# EAGLE schematic power_layout_SLIM (EAGLE 9.6.1)

## Sheet 1 of 2
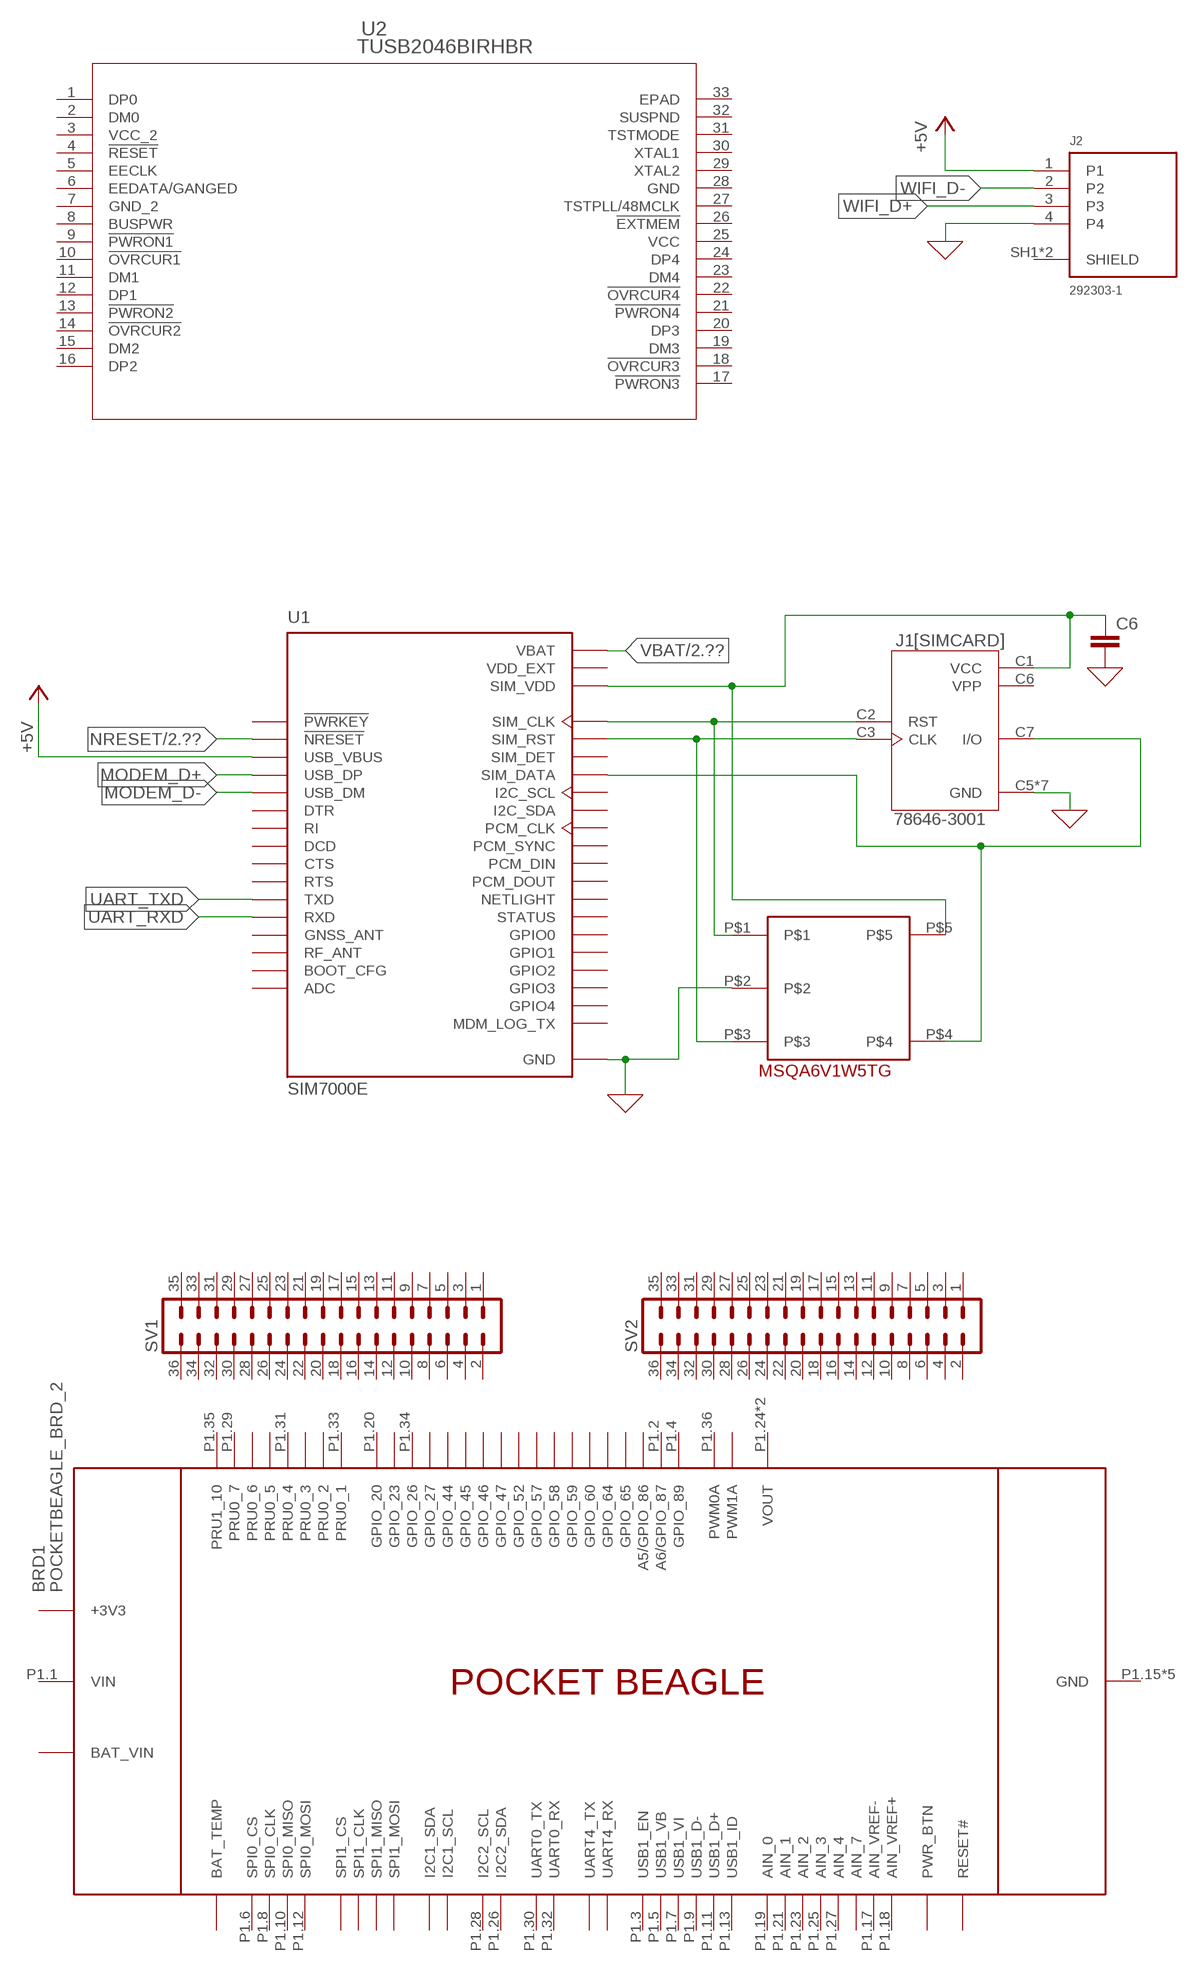
[diagram p0: schematic, sheet 1]

### Parts
BRD1  POCKETBEAGLE_BRD_2  [POCKETBEAGLE_BRD]
C6  C2,5-3  [C2.5-3]
J1[SIMCARD]  78646-3001  [MOLEX_78646-3001]
J2  292303-1  [TE_292303-1]
SV1  MA18-2  [MA18-2]
SV2  MA18-2  [MA18-2]
U1  SIM7000E  [SIMCON_SIM7000E]
U2  TUSB2046BIRHBR  [RHB32_3P45X3P45]
U$1  MSQA6V1W5T2G  [SOT-23-5_M5]

### Nets
0: C6.2 J1[SIMCARD].C5(GND) J1[SIMCARD].G1(GND) J1[SIMCARD].G2(GND) J1[SIMCARD].G3(GND) J1[SIMCARD].G4(GND) J1[SIMCARD].G5(GND) J1[SIMCARD].G6(GND) J2.4 U1.2(GND) U1.17(GND) U1.18(GND) U1.29(GND) U1.39(GND) U1.45(GND) U1.46(GND) U1.54(GND) U1.58(GND) U1.59(GND) U1.61(GND) U1.62(GND) U1.63(GND) U1.64(GND) U1.65(GND) U$1.P$2 ; supply symbol labelled GND ; also sheet 2
+5V: J2.1 U1.24(USB_VBUS) ; also sheet 2
MODEM_D+: U1.27(USB_DP)
MODEM_D-: U1.28(USB_DM)
N$1: C6.1 J1[SIMCARD].C1(VCC) U1.30(SIM_VDD) U$1.P$5
N$2: J1[SIMCARD].C3(CLK) U1.33(SIM_RST) U$1.P$3
N$4: J1[SIMCARD].C2(RST) U1.32(SIM_CLK) U$1.P$1
N$6: J1[SIMCARD].C7(I/O) U1.31(SIM_DATA) U$1.P$4
NRESET: U1.16(!NRESET) ; also sheet 2
UART_RXD: U1.10(RXD)
UART_TXD: U1.9(TXD)
VBAT: U1.55(VBAT) U1.56(VBAT) U1.57(VBAT) ; also sheet 2
WIFI_D+: J2.3
WIFI_D-: J2.2
Unconnected: BRD1.P1.1(VIN) BRD1.P1.2(A6/GPIO_87) BRD1.P1.3(USB1_EN) BRD1.P1.4(GPIO_89) BRD1.P1.5(USB1_VB) BRD1.P1.6(SPI0_CS) BRD1.P1.7(USB1_VI) BRD1.P1.8(SPI0_CLK) BRD1.P1.9(USB1_D-) BRD1.P1.10(SPI0_MISO) BRD1.P1.11(USB1_D+) BRD1.P1.12(SPI0_MOSI) BRD1.P1.13(USB1_ID) BRD1.P1.14(+3V3) BRD1.P1.15(GND) BRD1.P1.16(GND) BRD1.P1.17(AIN_VREF-) BRD1.P1.18(AIN_VREF+) BRD1.P1.19(AIN_0) BRD1.P1.20(GPIO_20) BRD1.P1.21(AIN_1) BRD1.P1.22(GND) BRD1.P1.23(AIN_2) BRD1.P1.24(VOUT) BRD1.P1.25(AIN_3) BRD1.P1.26(I2C2_SDA) BRD1.P1.27(AIN_4) BRD1.P1.28(I2C2_SCL) BRD1.P1.29(PRU0_7) BRD1.P1.30(UART0_TX) BRD1.P1.31(PRU0_4) BRD1.P1.32(UART0_RX) BRD1.P1.33(PRU0_1) BRD1.P1.34(GPIO_26) BRD1.P1.35(PRU1_10) BRD1.P1.36(PWM0A) BRD1.P2.1(PWM1A) BRD1.P2.2(GPIO_59) BRD1.P2.3(GPIO_23) BRD1.P2.4(GPIO_58) BRD1.P2.5(UART4_RX) BRD1.P2.6(GPIO_57) BRD1.P2.7(UART4_TX) BRD1.P2.8(GPIO_60) BRD1.P2.9(I2C1_SCL) BRD1.P2.10(GPIO_52) BRD1.P2.11(I2C1_SDA) BRD1.P2.12(PWR_BTN) BRD1.P2.13(VOUT) BRD1.P2.14(BAT_VIN) BRD1.P2.15(GND) BRD1.P2.16(BAT_TEMP) BRD1.P2.17(GPIO_65) BRD1.P2.18(GPIO_47) BRD1.P2.19(GPIO_27) BRD1.P2.20(GPIO_64) BRD1.P2.21(GND) BRD1.P2.22(GPIO_46) BRD1.P2.23(+3V3) BRD1.P2.24(GPIO_44) BRD1.P2.25(SPI1_MOSI) BRD1.P2.26(RESET#) BRD1.P2.27(SPI1_MISO) BRD1.P2.28(PRU0_6) BRD1.P2.29(SPI1_CLK) BRD1.P2.30(PRU0_3) BRD1.P2.31(SPI1_CS) BRD1.P2.32(PRU0_2) BRD1.P2.33(GPIO_45) BRD1.P2.34(PRU0_5) BRD1.P2.35(A5/GPIO_86) BRD1.P2.36(AIN_7) J2.SH1(SHIELD) J2.SH2(SHIELD) SV1.1 SV1.2 SV1.3 SV1.4 SV1.5 SV1.6 SV1.7 SV1.8 SV1.9 SV1.10 SV1.11 SV1.12 SV1.13 SV1.14 SV1.15 SV1.16 SV1.17 SV1.18 SV1.19 SV1.20 SV1.21 SV1.22 SV1.23 SV1.24 SV1.25 SV1.26 SV1.27 SV1.28 SV1.29 SV1.30 SV1.31 SV1.32 SV1.33 SV1.34 SV1.35 SV1.36 SV2.1 SV2.2 SV2.3 SV2.4 SV2.5 SV2.6 SV2.7 SV2.8 SV2.9 SV2.10 SV2.11 SV2.12 SV2.13 SV2.14 SV2.15 SV2.16 SV2.17 SV2.18 SV2.19 SV2.20 SV2.21 SV2.22 SV2.23 SV2.24 SV2.25 SV2.26 SV2.27 SV2.28 SV2.29 SV2.30 SV2.31 SV2.32 SV2.33 SV2.34 SV2.35 SV2.36 U1.1(!PWRKEY) U1.3(DTR) U1.4(RI) U1.5(DCD) U1.6(BOOT_CFG) U1.7(CTS) U1.8(RTS) U1.11(PCM_CLK) U1.12(PCM_SYNC) U1.13(PCM_DIN) U1.14(PCM_DOUT) U1.23(MDM_LOG_TX) U1.25(ADC) U1.34(SIM_DET) U1.37(I2C_SDA) U1.38(I2C_SCL) U1.48(GPIO4) U1.49(GPIO1) U1.50(GPIO0) U1.52(NETLIGHT) U1.53(GNSS_ANT) U1.60(RF_ANT) U1.66(STATUS) U1.67(GPIO2) U1.68(GPIO3) U2.1(DP0) U2.2(DM0) U2.4(!RESET) U2.5(EECLK) U2.6(EEDATA/GANGED) U2.8(BUSPWR) U2.9(!PWRON1) U2.10(!OVRCUR1) U2.11(DM1) U2.12(DP1) U2.13(!PWRON2) U2.14(!OVRCUR2) U2.15(DM2) U2.16(DP2) U2.17(!PWRON3) U2.18(!OVRCUR3) U2.19(DM3) U2.20(DP3) U2.21(!PWRON4) U2.22(!OVRCUR4) U2.23(DM4) U2.24(DP4) U2.26(!EXTMEM) U2.27(TSTPLL/48MCLK) U2.29(XTAL2) U2.30(XTAL1) U2.31(TSTMODE) U2.32(SUSPND) U2.33(EPAD)

## Sheet 2 of 2
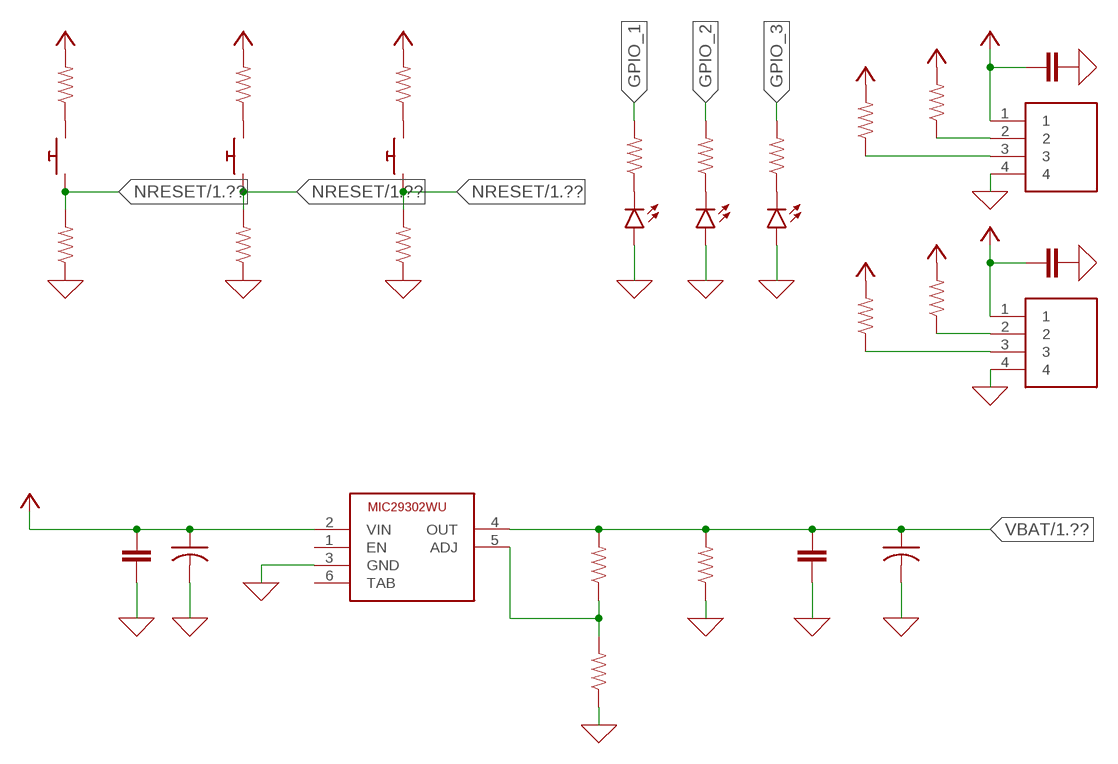
[diagram p1: schematic, sheet 2]

### Parts
C1  C2,5-3  [C2.5-3]
C2  0.1uF  C2,5-3  [C2.5-3]
C3  C2,5-3  [C2.5-3]
C4  C-US025-024X044  [C025-024X044]
C5  C-US025-024X044  [C025-024X044]
C7  0.1uF  C2,5-3  [C2.5-3]
D1  LED-3MM-NO_SILK  [LED_3MM-NS]
D2  LED-3MM-NO_SILK  [LED_3MM-NS]
D3  LED-3MM-NO_SILK  [LED_3MM-NS]
IC1  MIC29302WU  [TO263-5]
J3[GROVE]  640456-4  [TE_640456-4]
J4[GROVE]  640456-4  [TE_640456-4]
R1  RESISTOR0402  [0402]
R2  RESISTOR0402  [0402]
R3  RESISTOR0402  [0402]
R4  RESISTOR0402  [0402]
R5  RESISTOR0402  [0402]
R6  RESISTOR0402  [0402]
R7  RESISTOR0402  [0402]
R8  RESISTOR0402  [0402]
R9  RESISTOR0402  [0402]
R10  RESISTOR0402  [0402]
R11  RESISTOR0402  [0402]
R12  RESISTOR0402  [0402]
R13  RESISTOR0402  [0402]
R14  RESISTOR0402  [0402]
R15  RESISTOR0402  [0402]
R16  RESISTOR0402  [0402]
SW1  SWITCH_PUSHBUTTONSOFTTOUCHSMD_SJ  [PUSHBUTTON_SMD_SJ]
SW2  SWITCH_PUSHBUTTONSOFTTOUCHSMD_SJ  [PUSHBUTTON_SMD_SJ]
SW3  SWITCH_PUSHBUTTONSOFTTOUCHSMD_SJ  [PUSHBUTTON_SMD_SJ]

### Nets
0: C1.2 C2.1 C3.2 C4.2 C5.2 C7.1 D1.A D2.A D3.A IC1.3(GND) J3[GROVE].4 J4[GROVE].4 R4.1 R6.1 R10.1 R14.1 R16.1 ; supply symbol labelled GND ; also sheet 1
+5V: C1.1 C2.2 C4.1 C7.2 IC1.2(VIN) J3[GROVE].1 J4[GROVE].1 R7.2 R8.2 R9.2 R11.2 R12.2 R13.2 R15.2 ; also sheet 1
GPIO_1: R3.2
GPIO_2: R2.2
GPIO_3: R1.2
N$3: IC1.5(ADJ) R4.2 R5.1
N$5: D3.K(C) R1.1
N$7: D2.K(C) R2.1
N$8: D1.K(C) R3.1
N$9: J3[GROVE].2 R7.1
N$10: J3[GROVE].3 R8.1
N$11: R9.1 SW1.P$2
N$12: J4[GROVE].2 R11.1
N$13: J4[GROVE].3 R12.1
N$14: R13.1 SW2.P$2
N$15: R15.1 SW3.P$2
NRESET: R10.2 R14.2 R16.2 SW1.P$1 SW2.P$1 SW3.P$1 ; also sheet 1
VBAT: C3.1 C5.1 IC1.4(OUT) R5.2 R6.2 ; also sheet 1
Unconnected: IC1.1(EN) IC1.6(TAB)

## Power pins joined to a net without a drawn wire
GND: U2.28(GND)
GND_2: U2.7(GND_2)
VCC: U2.25(VCC)
VCC_2: U2.3(VCC_2)
VDD_EXT: U1.15(VDD_EXT)
VPP: J1[SIMCARD].C6(VPP)

## Library data of the parts
BRD1 = e14_BeagleBoard_PocketBeagle_v1_alpha1:POCKETBEAGLE_?_2: BeagleBoard.org PocketBeagle What is PocketBeagle? PocketBeagle is an ultra-tiny-yet-complete open-source USB-key-fob computer. PocketBeagle features an incredible low cost, slick design and simple usage, making PocketBeagle the ideal development board for beginners and professionals alike. Processor: Octavo Systems OSD3358 1GHz ARMÂ® Cortex-A8 512MB DDR3 RAM integrated Integrated power management 2Ã—32-bit 200-MHz programmable real-time units (PRUs) ARM Cortex-M3 Summary of Key Features Low cost Linux computer with tremendous expansibility Opportunity to learn many programming aspects from educators on-line Openness and flexibility tear-down limits on your imagination Summary of Technical Specifications Based on new Octavo Systems OSD3358-SM 21mm x 21mm system-in-package that includes 512MB DDR3 RAM, 1-GHz ARM Cortex-A8 CPU, 2x 200-MHz PRUs, ARM Cortex-M3, 3D accelerator, power/battery management and EEPROM 72 expansion pin headers with power and battery I/Os, high-speed USB, 8 analog inputs, 44 digital I/Os and numerous digital interface peripherals microUSB host/client and microSD connectors
C1-C3 C6 C7 = capacitor-wima:C: CAPACITOR naming: grid - package width
C4 C5 = rcl:C-US: CAPACITOR, American symbol; SPICEPREFIX: C
D1-D3 = SparkFun-LED:LED: LED (Generic) Standard schematic elements and footprints for 5mm, 3mm, 1206, and 0603 sized LEDs. Generic LEDs with no color specified.
IC1 = MIC29302WU:MIC29302WU; AVAILABILITY: Unavailable; DESCRIPTION: Linear Voltage Regulator IC 1 Output 3A TO-263-5; MF: Microchip Technology; MP: MIC29302WU; PACKAGE: TO-263-6 Microchip Technology; PRICE: None
J1[SIMCARD] = 78646-3001:78646-3001: Conn Micro SIM Card SKT 6 POS 2.54mm Solder RA SMD 0.5A/Contact Embossed T/R; AVAILABILITY: Unavailable; DESCRIPTION: 6 Position Card Connector Micro SIM Surface Mount, Right Angle Gold; MF: Molex; MP: 78646-3001; PACKAGE: None; PRICE: None
J2 = 292303-1:292303-1: CONN USB RECEPT R/A TYPE A 4POS; AVAILABILITY: Unavailable; CENTERLINE_PITCH: 2 mm[.078 in]; COMMENT: 292303-1; DESCRIPTION: Conn; Data; USB; Recept; 2.0; 4 Pos; 1 Port; Rt Angle; A Ser; Tin over Copper; EU_ROHS_COMPLIANCE: Compliant; MF: TE Connectivity; MP: 292303-1; NUMBER_OF_POSITIONS: 4; PACKAGE: None; PRICE: None; PRODUCT_TYPE: Connector; TE_PURCHASE_URL: https://www.te.com/usa-en/product-292303-1.html?te_bu=Cor&te_type=disp&te_campaign=seda_glo_cor-seda-global-disp-prtnr-fy19-seda-model-bom-cta_sma-317_1&elqCampaignId=32493
J3[GROVE] J4[GROVE] = 640456-4:640456-4: 220P MTA100 HDR ASSY SQ SPCL; CENTERLINE_PITCH: 2.54 mm[.1 in]; COMMENT: 640456-4; DESCRIPTION: Header, Friction Lock; MTA-100; 4; 250 VAC; Polyester; Tin; Copper Alloy; Tin; DIGI-KEY_PART_NUMBER: A1922-ND; DIGI-KEY_PURCHASE_URL: https://www.digikey.com/product-detail/en/te-connectivity-amp-connectors/640456-4/A1922-ND/109006?utm_source=snapeda&utm_medium=aggregator&utm_campaign=symbol; EU_ROHS_COMPLIANCE: Compliant; MF: TE Connectivity; MP: 640456-4; NUMBER_OF_POSITIONS: 4; PACKAGE: None; PRODUCT_TYPE: Connector; TE_PURCHASE_URL: https://www.te.com/usa-en/product-640456-4.html?te_bu=Cor&te_type=disp&te_campaign=seda_glo_cor-seda-global-disp-prtnr-fy19-seda-model-bom-cta_sma-317_1&elqCampaignId=32493
R1-R16 = SparkFun-Resistors:RESISTOR: Generic Resistor Package
SV1 SV2 = con-lstb:MA18-2: PIN HEADER; OC_FARNELL: unknown; OC_NEWARK: unknown
SW1-SW3 = adafruit:SWITCH_PUSHBUTTON: Buttons SOFTTOUCHSMD_SJ - Soft touch temporary push button (Super Junk Akihabara) Compatible with SKPMANE010 [Mouser: 688-SKPMAN] C&K_KSS = Digikey: KSS221GLFS
U1 = SIM7000E:SIM7000E: Multi-Band LTE-FDD and Dual-Band GSM/GPRS/EDGE module solution in a SMT type which supports LTE eMTC(CAT-M1) and NB-IoT up to 375kbps for downlink data transfer.; AVAILABILITY: Unavailable; DESCRIPTION: SIM7000E GSM/GPRS RF Arduino Platform Evaluation Expansion Board; MF: DFRobot; MP: SIM7000E; PACKAGE: Package Analog Devices; PRICE: None
U2 = TUSB2046B:TUSB2046BIRHBR; DATASHEET_URL: http://www.ti.com/lit/gpn/TUSB2046B; DESCRIPTION: 4-Port Full-Speed Universal Serial Bus Hub; FAMILY_NAME: USB HUB CONTROLLER; GENERIC_PART_NUMBER: TUSB2046B; INDUSTRY_STD_PKG_TYPE: QFN; MANUFACTURER: Texas Instruments; MANUFACTURER_PART_NUMBER: TUSB2046BIRHBR; PACKAGE_DESIGNATOR: RHB; PIN_COUNT: 32; VENDOR: Texas Instruments
U$1 = Personal:MSQA6V1W5T2G: MSQA6V1W5T2G TVS DIODE 3V SC88A Clamp Ipp Tvs Diode Surface Mount SC-88A (SC-70-5/SOT-353) https://www.digikey.com/product-detail/en/on-semiconductor/MSQA6V1W5T2G/MSQA6V1W5T2GOSDKR-ND/1967490